# Altium schematic sheet Misc_switches.SchDoc: RP2040 CNC
size B; Author: AM; CompanyName: Expatria Technologies; DrawnBy: A.Marles; Engineer: AM; Organization: Expatria Technolgoies; Address1: PO Box 2084; Address3: Merritt, BC V1K 1B8; Address4: Canada; DocumentNumber: 20; SheetNumber: 17; SheetTotal: 26
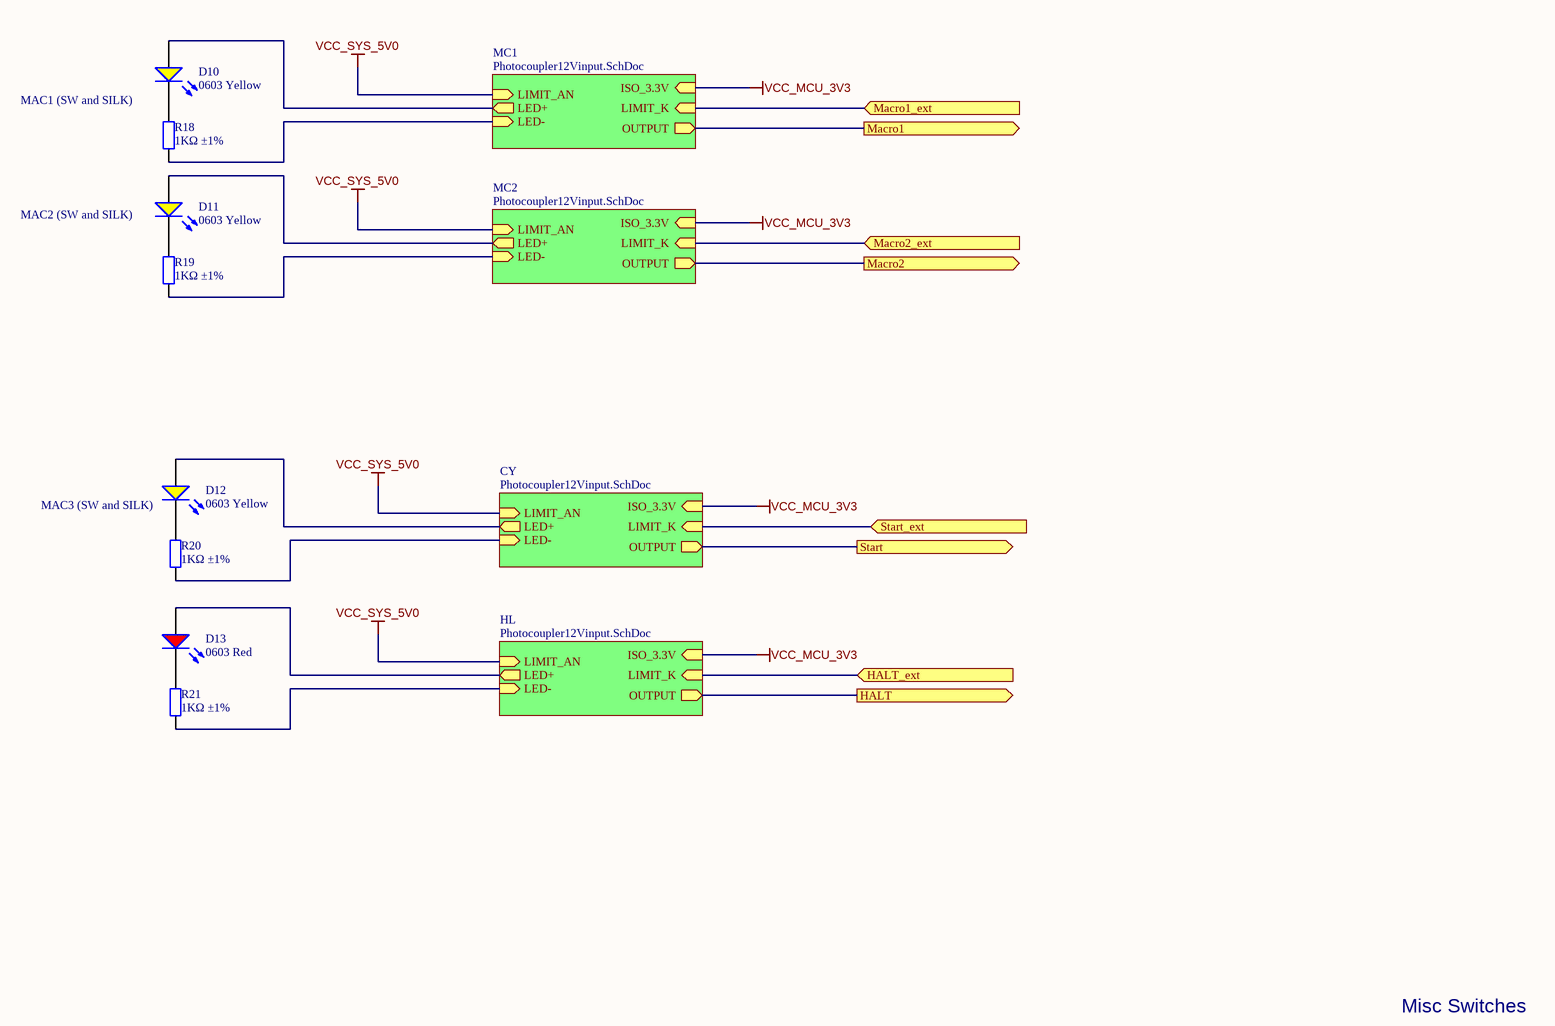
[diagram p0: Misc_switches.SchDoc]

## Parts
D10  0603 Yellow  [0603_LED_S1 - YELLOW]
D11  0603 Yellow  [0603_LED_S1 - YELLOW]
D12  0603 Yellow  [0603_LED_S1 - YELLOW]
D13  0603 Red  [0603_LED_S1]
R18  1KΩ ±1%  [0402_R]
R19  1KΩ ±1%  [0402_R]
R20  1KΩ ±1%  [0402_R]
R21  1KΩ ±1%  [0402_R]

## Sub-sheets
CY = Photocoupler12Vinput.SchDoc: OUTPUT (out), LED- (in), LED+ (out), ISO_3.3V (in), LIMIT_AN (in), LIMIT_K (in)
HL = Photocoupler12Vinput.SchDoc: OUTPUT (out), LED+ (out), LED- (in), ISO_3.3V (in), LIMIT_AN (in), LIMIT_K (in)
MC1 = Photocoupler12Vinput.SchDoc: OUTPUT (out), LED+ (out), LED- (in), ISO_3.3V (in), LIMIT_AN (in), LIMIT_K (in)
MC2 = Photocoupler12Vinput.SchDoc: OUTPUT (out), LED+ (out), LED- (in), ISO_3.3V (in), LIMIT_AN (in), LIMIT_K (in)

## Ports
HALT (out), HALT_ext (in), Macro1 (out), Macro1_ext (in), Macro2 (out), Macro2_ext (in), Start (out), Start_ext (in)

## Nets
VCC_MCU_3V3: sheet CY/ISO_3.3V, sheet MC1/ISO_3.3V, sheet HL/ISO_3.3V, sheet MC2/ISO_3.3V
VCC_SYS_5V0: sheet CY/LIMIT_AN, sheet MC1/LIMIT_AN, sheet HL/LIMIT_AN, sheet MC2/LIMIT_AN
HALT: port HALT, sheet HL/OUTPUT
HALT_ext: port HALT_ext, sheet HL/LIMIT_K
Macro1: port Macro1, sheet MC1/OUTPUT
Macro1_ext: port Macro1_ext, sheet MC1/LIMIT_K
Macro2: port Macro2, sheet MC2/OUTPUT
Macro2_ext: port Macro2_ext, sheet MC2/LIMIT_K
Start: port Start, sheet CY/OUTPUT
Start_ext: port Start_ext, sheet CY/LIMIT_K
NetD10_A: D10.A ; sheet MC1/LED+
NetD10_K: D10.K R18.1
NetD11_A: D11.A ; sheet MC2/LED+
NetD11_K: D11.K R19.1
NetD12_A: D12.A ; sheet CY/LED+
NetD12_K: D12.K R20.1
NetD13_A: D13.A ; sheet HL/LED+
NetD13_K: D13.K R21.1
NetR18_2: R18.2 ; sheet MC1/LED-
NetR19_2: R19.2 ; sheet MC2/LED-
NetR20_2: R20.2 ; sheet CY/LED-
NetR21_2: R21.2 ; sheet HL/LED-

## Notes on the sheet
- MAC1 (SW and SILK)
- MAC2 (SW and SILK)
- MAC3 (SW and SILK)
- Misc Switches
- SHEET
- Expatria Technologies
- 625 Kane Valley Rd.
- Box 2084
- Merritt, BC V1K1B8
- PROJECT
- SIZE
- ENGR
- MODIFIED
- DOCUMENT
- REV
- Copyright Sienci Labs 2024. This document describes Open Hardware and is licensed under the CERN-OHL-S v2. No warranty is implied or expressed.
- EMAIL: INFO@EXPATRIA.CA
- B
- /

## Library data of the parts
D10-D12 = 0603 LED Yellow: LED; ComponentLink1Description: 供应商链接; ComponentLink1URL: http://www.szlcsc.com/product/details_73147.html; Package: 0603; Supplier: LC; SuppliersPartNumber: C72038; Color: Yellow
D13 = 19-213SURC/S530-A3/TR8: 20mA 632nm Colorless transparence 624nm~624nm -40℃~+85℃ Red 120° 60mW 0603 Light Emitting Diodes (LED) ROHS; Manufacturer: Everlight Elec; ComponentLink1Description: 供应商链接; ComponentLink1URL: http://www.szlcsc.com/product/details_2659.html; Package: 0603; Supplier: LC; SuppliersPartNumber: C72039; Color: Red; Supplier 1: LC; Supplier Part Number 1: C72039; Manufacturer Part Number: 19-213SURC/S530-A3/TR8
R18-R21 = 0402 1K (1001) 1%: Chip resistor; Manufacturer: Uniroyal Elec; PartNumber: 0402WGF1001TCE; Power: 1/16W; ComponentLink1Description: Supplier link; ComponentLink1URL: http://www.szlcsc.com/product/details_12256.html; Package: 0402; Supplier: LC; SuppliersPartNumber: C11702; Resistance: 1KΩ; Tolerance: 1%; Manufacturer Part Number: 0402WGF1001TCE